# Altium project Full_Bridge_Module.PrjPcb
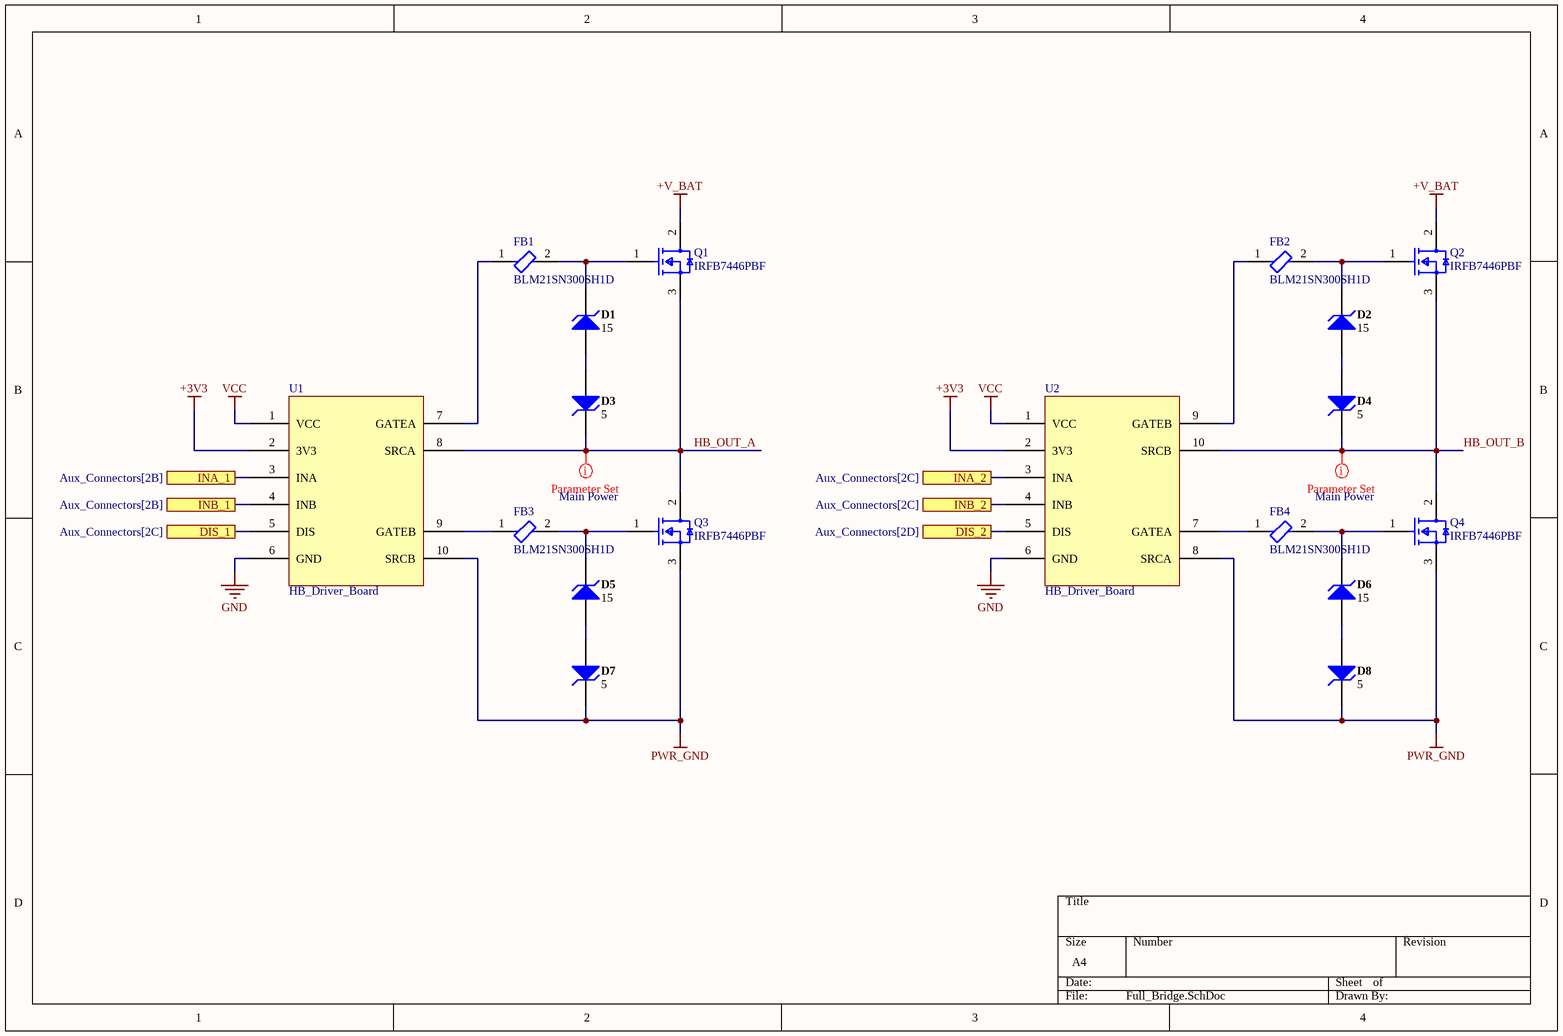
[diagram p0: Full_Bridge.SchDoc]
2 sheets, 35 parts. Net scope: flat (ports and power ports of the same name join across sheets).
Board file: Full_Bridge.PcbDoc
Sheets:
  Full_Bridge.SchDoc
  Aux_Connectors.SchDoc

## Sheet Full_Bridge.SchDoc
size A4; SheetNumber: 1; SheetTotal: 2

### Parts
D1  15  [VISH-SOD-123-2_V]
D2  15  [VISH-SOD-123-2_V]
D3  5  [VISH-SOD-123-2_V]
D4  5  [VISH-SOD-123-2_V]
D5  15  [VISH-SOD-123-2_V]
D6  15  [VISH-SOD-123-2_V]
D7  5  [VISH-SOD-123-2_V]
D8  5  [VISH-SOD-123-2_V]
FB1  BLM21SN300SH1D  [FP-BLM21-0_2-t0_85-e0_5-d-IPC_A]
FB2  BLM21SN300SH1D  [FP-BLM21-0_2-t0_85-e0_5-d-IPC_A]
FB3  BLM21SN300SH1D  [FP-BLM21-0_2-t0_85-e0_5-d-IPC_A]
FB4  BLM21SN300SH1D  [FP-BLM21-0_2-t0_85-e0_5-d-IPC_A]
Q1  IRFB7446PBF  [FP-PG-TO220-3-MFG]
Q2  IRFB7446PBF  [FP-PG-TO220-3-MFG]
Q3  IRFB7446PBF  [FP-PG-TO220-3-MFG]
Q4  IRFB7446PBF  [FP-PG-TO220-3-MFG]
U1  HB_Driver_Board  [HB_Driver]
U2  HB_Driver_Board  [HB_Driver]

### Ports
DIS_1 (see Aux_Connectors[2C]), DIS_2 (see Aux_Connectors[2D]), INA_1 (see Aux_Connectors[2B]), INA_2 (see Aux_Connectors[2C]), INB_1 (see Aux_Connectors[2B]), INB_2 (see Aux_Connectors[2C])

### Nets
+3V3: U1.2(3V3) U2.2(3V3)
+V_BAT: Q1.2(D) Q2.2(D)
GND: U1.6(GND) U2.6(GND)
PWR_GND: D7.2(K) D8.2(K) Q3.3(S) Q4.3(S) U1.10(SRCB) U2.8(SRCA)
VCC: U1.1(VCC) U2.1(VCC)
HB_OUT_A: D3.2(K) Q1.3(S) Q3.2(D) U1.8(SRCA)
HB_OUT_B: D4.2(K) Q2.3(S) Q4.2(D) U2.10(SRCB)
NetD1_1: D1.1(A) D3.1(A)
NetD1_2: D1.2(K) FB1.2 Q1.1(G)
NetD2_1: D2.1(A) D4.1(A)
NetD2_2: D2.2(K) FB2.2 Q2.1(G)
NetD5_1: D5.1(A) D7.1(A)
NetD5_2: D5.2(K) FB3.2 Q3.1(G)
NetD6_1: D6.1(A) D8.1(A)
NetD6_2: D6.2(K) FB4.2 Q4.1(G)
NetFB1_1: FB1.1 U1.7(GATEA)
NetFB2_1: FB2.1 U2.9(GATEB)
NetFB3_1: FB3.1 U1.9(GATEB)
NetFB4_1: FB4.1 U2.7(GATEA)
NetJ1_3: U1.3(INA) ; port INA_1
NetJ1_7: U1.4(INB) ; port INB_1
NetJ1_11: U1.5(DIS) ; port DIS_1
NetJ1_21: U2.3(INA) ; port INA_2
NetJ1_25: U2.4(INB) ; port INB_2
NetJ1_29: U2.5(DIS) ; port DIS_2

### Layout directives
net class Main Power: HB_OUT_A, HB_OUT_B

### Library data of the parts
D1 D2 D5 D6 = CMP-0931-00033-1: Small Signal Zener Diode, 15 V +/- 5%, -55 to 155 degC, 2-Pin SOD-123, RoHS, Tape and Reel; Manufacturer: Vishay Semiconductor; PartNumber: MMSZ5245B-E3-08; Int. Construction: Single; Test Current (IZT1) (mA): 8.5; Zener Impedance (IZT1) (Max.) (Ohm): 16; Power Dissipation (mW): 500; Tolerance: +/- 5%; PackageDescription: 2-Pin SMD, Body 2.7 x 1.55 mm, Height 1.35 mm; ComponentLink2Description: Datasheet; PackageVersion: Rev. 1.9; ComponentLink2URL: http://www.vishay.com/docs/85774/mmsz5225.pdf; RoHS: TRUE; Packing: Tape and Reel; Zener Voltage (NOM.) (V): 15; Operating Temperature: -55 to 150 degC; ComponentLink1Description: Manufacturer URL; ComponentLink3Description: Package Specification; PackageReference: SOD-123-2; DatasheetVersion: Rev. 1.9; ComponentLink3URL: http://www.vishay.com/docs/85774/mmsz5225.pdf; Mounting Technology: Surface Mount; ComponentLink1URL: http://www.vishay.com/
D3 D4 D7 D8 = CMP-0931-00024-1: Small Signal Zener Diode, 5.1 V +/- 5%, -55 to 155 degC, 2-Pin SOD-123, RoHS, Tape and Reel; Manufacturer: Vishay Semiconductor; PartNumber: MMSZ5231B-E3-08; Tolerance: +/- 5%; Test Current (IZT1) (mA): 20; Zener Impedance (IZT1) (Max.) (Ohm): 17; Zener Voltage (NOM.) (V): 5.1; Power Dissipation (mW): 500; Int. Construction: Single; RoHS: TRUE; PackageDescription: 2-Pin SMD, Body 2.7 x 1.55 mm, Height 1.35 mm; ComponentLink1Description: Manufacturer URL; Packing: Tape and Reel; Operating Temperature: -55 to 150 degC; PackageReference: SOD-123-2; Mounting Technology: Surface Mount; ComponentLink3URL: http://www.vishay.com/docs/85774/mmsz5225.pdf; ComponentLink3Description: Package Specification; ComponentLink2Description: Datasheet; DatasheetVersion: Rev. 1.9; PackageVersion: Rev. 1.9; ComponentLink2URL: http://www.vishay.com/docs/85774/mmsz5225.pdf; ComponentLink1URL: http://www.vishay.com/
FB1-FB4 = CMP-06046-001922-1: Chip Ferrite Bead, 0805, 30Ω @ 100MHz, 0.004Ω, ±10Ω, 8.5A; Number of Lines: 1; DC Resistance (DCR): 4mR; Packaging: Tape and Reel; Length: 0.079inch; Case Code (Metric): 2012; Max Operating Temperature: 125°C; Case Code (Imperial): 0805; Max Current Rating: 8.5A; Width: 0.049inch; Ratings: AEC-Q200; Height: 0.041inch; RoHS Compliant: Yes; Min Operating Temperature: -55°C; Package Quantity: 4000; Mount: Surface Mount; Case/Package: 0805
Q1-Q4 = CMP-32901-000256-1: MOSFET N-CH 40V 120A TO220AB; Rds On Max: 2.5mR; Input Capacitance: 4.73nF; Max Power Dissipation: 143W; Threshold Voltage: 3V; Lead Free: Lead Free; Number of Pins: 3; Max Operating Temperature: 175°C; Max Dual Supply Voltage: 40V; RoHS Compliant: Yes; Continuous Drain Current (ID): 120A; Packaging: Rail/Tube; Case/Package: TO-220; REACH SVHC: No SVHC; Min Operating Temperature: -55°C; Mount: Through Hole; Drain to Source Voltage (Vdss): 40V; Halogen Free: Halogen Free

## Sheet Aux_Connectors.SchDoc
size A4; SheetNumber: 2; SheetTotal: 2
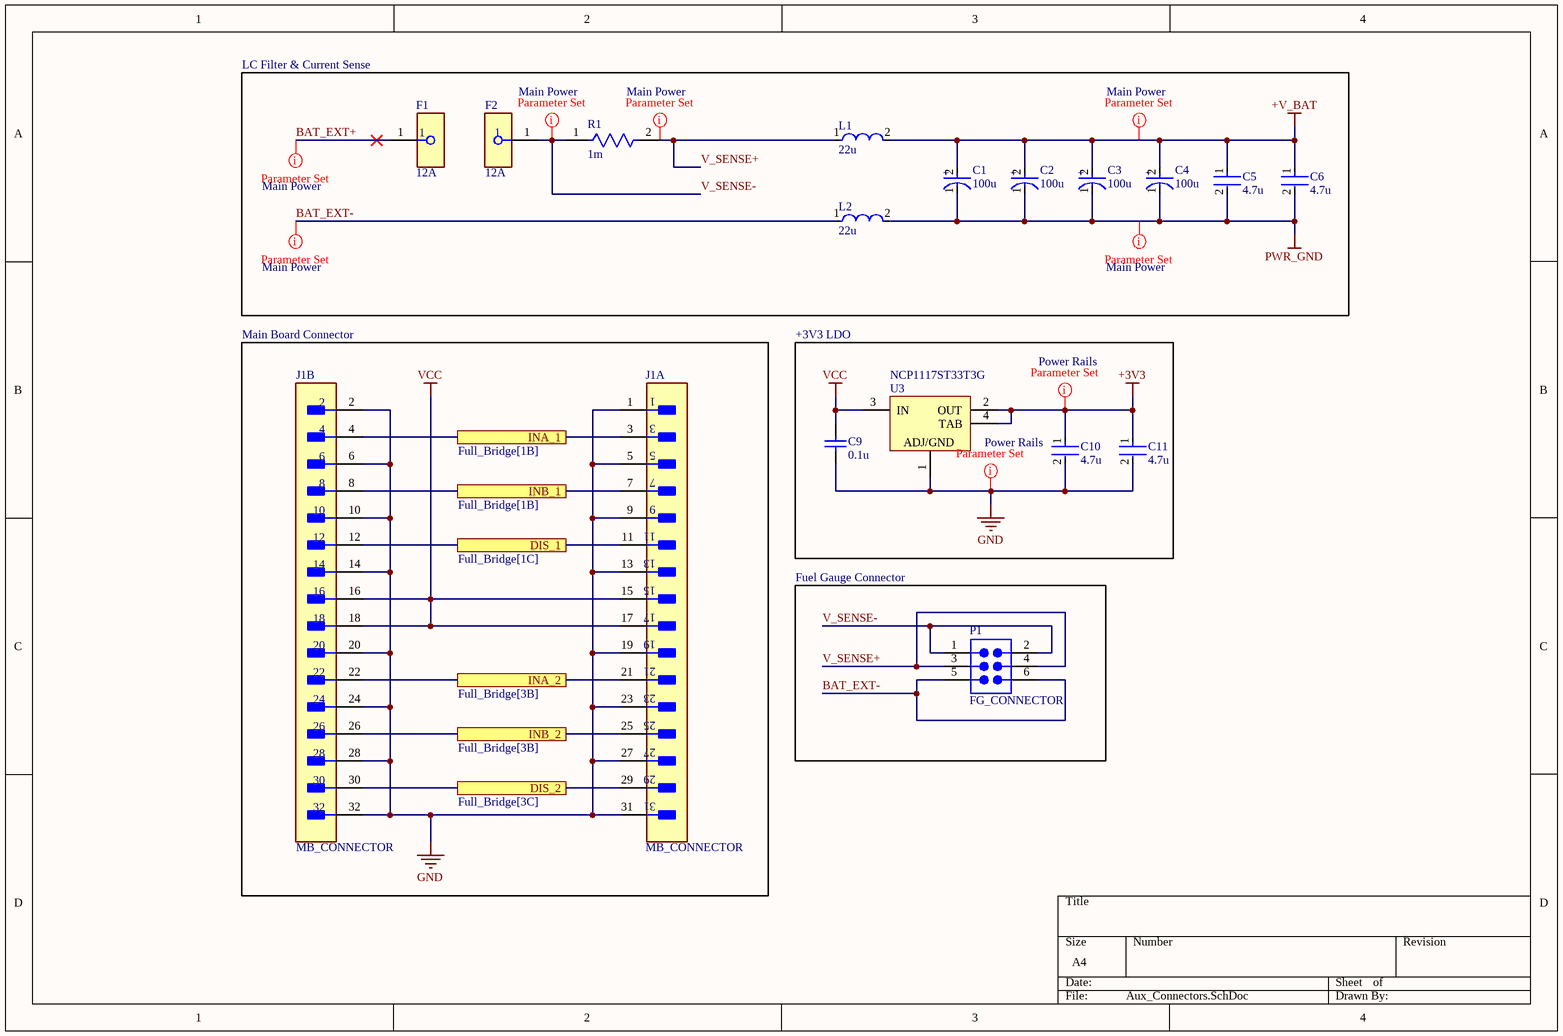
[diagram p1: Aux_Connectors.SchDoc]

### Parts
C1  100u  [FP-EEHA-G-MFG]
C2  100u  [FP-EEHA-G-MFG]
C3  100u  [FP-EEHA-G-MFG]
C4  100u  [FP-EEHA-G-MFG]
C5  4.7u  [FP-GRM31C-0_2-e0_3_0_8-IPC_C]
C6  4.7u  [FP-GRM31C-0_2-e0_3_0_8-IPC_C]
C9  0.1u  [CAPC2013X145X48NL20T23]
C10  4.7u  [FP-GRM31C-0_2-e0_3_0_8-IPC_C]
C11  4.7u  [FP-GRM31C-0_2-e0_3_0_8-IPC_C]
F1  12A  [FP-8040_0001-MFG]
F2  12A  [FP-8040_0001-MFG]
J1  MB_CONNECTOR  [FP-MTSW-116-22-G-D-315-MFG]  (parts A,B of 2)
L1  22u  [FP-PA2247_223NLT-MFG]
L2  22u  [FP-PA2247_223NLT-MFG]
P1  FG_CONNECTOR  [SMTC-MTSW-103-07-X-D-244]
R1  1m  [FP-WSLF2512-0_43-MFG]
U3  NCP1117ST33T3G  [ONSC-SOT-223-4-318H-01_A_V]

### Blocks framed on the sheet
LC Filter & Current Sense: C1-C6 F1 F2 L1 L2 R1
Main Board Connector: J1
+3V3 LDO: C9-C11 U3
Fuel Gauge Connector: P1

### Ports
DIS_1 (see Full_Bridge[1C]), DIS_2 (see Full_Bridge[3C]), INA_1 (see Full_Bridge[1B]), INA_2 (see Full_Bridge[3B]), INB_1 (see Full_Bridge[1B]), INB_2 (see Full_Bridge[3B])

### Nets
+3V3: C10.1 C11.1 U3.2(OUT) U3.4(TAB)
+V_BAT: C1.2(A) C2.2(A) C3.2(A) C4.2(A) C5.1 C6.1 L1.2
GND: C9.1 C10.2 C11.2 J1.1 J1.2 J1.5 J1.6 J1.9 J1.10 J1.13 J1.14 J1.19 J1.20 J1.23 J1.24 J1.27 J1.28 J1.31 J1.32 U3.1(ADJ/GND)
PWR_GND: C1.1(C) C2.1(C) C3.1(C) C4.1(C) C5.2 C6.2 L2.2
VCC: C9.2 J1.15 J1.16 J1.17 J1.18 U3.3(IN)
BAT_EXT+: F1.1
BAT_EXT-: L2.1 P1.5 P1.6
V_SENSE+: L1.1 P1.3 P1.4 R1.2
V_SENSE-: F2.1 P1.1 P1.2 R1.1
NetJ1_3: J1.3 J1.4 ; port INA_1
NetJ1_7: J1.7 J1.8 ; port INB_1
NetJ1_11: J1.11 J1.12 ; port DIS_1
NetJ1_21: J1.21 J1.22 ; port INA_2
NetJ1_25: J1.25 J1.26 ; port INB_2
NetJ1_29: J1.29 J1.30 ; port DIS_2

### Layout directives
net class Main Power: +V_BAT, BAT_EXT+, BAT_EXT-, PWR_GND, V_SENSE+, V_SENSE-
net class Power Rails: +3V3, GND

### Notes on the sheet
- (in symbol CMP-05428-000952-1) +

### Library data of the parts
C1-C4 = CMP-05428-000952-1: Conductive Polymer Hybrid Aluminum Electrolytic Capacitors 100uF ±20% 50V RADIAL TH 10x9.5mm
C5 C6 C10 C11 = CMP-06035-057352-1: Chip Multilayer Ceramic Capacitors for General Purpose, 1206, 4.7uF, X7R, 15%, 20%, 50V; Height: 1.6mm; Capacitance: 4.7uF; Radiation Hardening: No; Min Operating Temperature: -55°C; Tolerance: 20%; Packaging: Tape and Reel; Case Code (Imperial): 1206; Mount: Surface Mount; Termination: SMD/SMT; Case/Package: 1206; Depth: 1.6mm; Width: 0.063inch; Max Operating Temperature: 125°C; Thickness: 0.071inch; Voltage Rating (DC): 50V; Package Quantity: 2000; Voltage Rating: 50V; Lead Free: Lead Free; Length: 3.2mm; Case Code (Metric): 3216; Dielectric: X7R
C9 = CMP-2007-01705-1: Part Number: VJ0805Y104KXAMR; Manufacturer: Vitramon
F1 F2 = CMP-26292-000011-1: FUSE CLIP CARTRIDGE 600V 32A PCB; Material: Copper; Fuse Size: 1/4" Dia x 1-1/4" L (6.35mm x 31.8mm); Number of Circuits: 1; Color: Silver; Orientation: Horizontal; Current Rating: 32A; Packaging: Bulk; Min Operating Temperature: -55°C; Max Operating Temperature: 125°C; Width: 7.2mm; Weight: 0.070548oz; Length: 8mm; Radiation Hardening: No; REACH SVHC: No SVHC; Termination: PC Pin; Package Quantity: 1000; Depth: 8.2mm; Fuse Current: 32A; Voltage Rating (DC): 600V; Mount: PCB; Height: 14.3mm; Voltage Rating (AC): 600V; Contact Plating: Tin; Voltage: 600V; Contact Material: Copper; Series: CQP
J1 = CMP-02766-000676-1: CONN HEADER VERT 32POS 2.54MM; Contact Plating: Gold; Lead Free: Lead Free; Contact Material: Bronze; Number of Rows: 2
L1 L2 = CMP-16293-000010-1: FIXED IND 22UH 16A 15.8MOHM SMD
P1 = CMP-1024-00096-1: Modified .025" SQ Post Header, Through-hole, Vertical, -55 to 125 degC, 2.54 mm Pitch, 6-Pin, Male, RoHS; Manufacturer: Samtec; PartNumber: MTSW-103-07-G-D-244; Pitch: 2.54 mm; PackageVersion: BI, 2/1987; ComponentLink3Description: Package Specification; PackageDescription: Assembly .025" [.64] SQ Post Terminal Strip; PackageReference: MTSW-103-07-X-D-244; Temperature Range: -55 to 125 degC; RoHS: True; ComponentLink2URL: http://www.samtec.com/documents/webfiles/pdf/MTSW.PDF; ComponentLink3URL: http://www.samtec.com/documents/webfiles/cpdf/MTSW-XXX-XX-X-X-XXXX-XX-XXX-MKT1.pdf; ComponentLink2Description: Datasheet; ComponentLink1URL: http://www.samtec.com; ComponentLink1Description: Manufacturer URL; Mounting Technology: Through-hole; Orientation: Vertical; DatasheetVersion: F-214
R1 = CMP-02407-013110-1: RES 0.001 OHM 1% 5W 2512; Resistance: 1mR; Temperature Coefficient: 170ppm/°C; Series: WSLF; RoHS Compliant: Yes; Min Operating Temperature: -65°C; Features: Moisture Resistant; Number of Terminations: 2; Case Code (Metric): 6432; Lead Free: Lead Free; Tolerance: 1%; Case Code (Imperial): 2512; Width: 0.125inch; Max Operating Temperature: 170°C; Case/Package: 2512; Resistor Type: Metal Element; Ratings: AEC-Q200; Packaging: Cut Tape; Height: 0.024inch; Max Power Dissipation: 5W; Length: 0.25inch
U3 = CMP-1679-00010-1: Low-Dropout Positive Fixed Voltage Regulator, 1 A, 3.3 V Output Voltage, 0 to 125 degC, 4-Pin SOT-223 (318H-01), Pb-Free, Tape and Reel; Resistance: 220 kohm; Type (Resistor): Thick Film; Voltage Rating: 75 V; Tolerance: 1%; Case\Package: 0603; Power Rating: 100 mW; Width: 0.85 mm; Weight: 7.1E-05 oz; ComponentLink2URL: http://www.onsemi.com/pub_link/Collateral/NCP1117-D.PDF; RoHSCompliant: true; Height: 0.45 mm; PackageDescription: 4-Pin Small Outline Transistor, Body 6.5 x 3.5 mm, Pitch 2.3 mm; ComponentLink1Description: Manufacturer URL; ComponentLink1URL: http://www.onsemi.com/; PackageReference: SOT-223-4-318H-01_A; Max Operating Temperature: 155 degC; Packaging: Tape and Reel; REACH SVHC: Unknown; Length: 1.55 mm; Package Quantity: 5000; Radiation Hardening: No; Min Operating Temperature: -55 degC; DatasheetVersion: Rev. 27, 09/2014; Mount: Surface Mount; Case Code (Imperial): 0603; Case Code (Metric): 1608; ComponentLink2Description: Datasheet

## Nets that join several sheets
+3V3: Full_Bridge (U1.2 U2.2), Aux_Connectors (C10.1 C11.1 U3.2 U3.4)
+V_BAT: Full_Bridge (Q1.2 Q2.2), Aux_Connectors (7 pins)
GND: Full_Bridge (U1.6 U2.6), Aux_Connectors (20 pins)
PWR_GND: Full_Bridge (6 pins), Aux_Connectors (7 pins)
VCC: Full_Bridge (U1.1 U2.1), Aux_Connectors (6 pins)
NetJ1_3: Full_Bridge (U1.3), Aux_Connectors (J1.3 J1.4)
NetJ1_7: Full_Bridge (U1.4), Aux_Connectors (J1.7 J1.8)
NetJ1_11: Full_Bridge (U1.5), Aux_Connectors (J1.11 J1.12)
NetJ1_21: Full_Bridge (U2.3), Aux_Connectors (J1.21 J1.22)
NetJ1_25: Full_Bridge (U2.4), Aux_Connectors (J1.25 J1.26)
NetJ1_29: Full_Bridge (U2.5), Aux_Connectors (J1.29 J1.30)